# EAGLE design Prog (EAGLE 8.4.0)
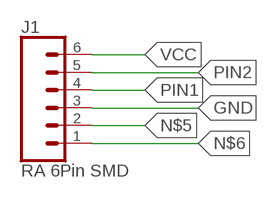
[diagram p0: schematic, sheet 1]

## Parts
J1  RA 6Pin SMD  CONN_06SMD  [1X06-SMD_RA_MALE]

## Nets
GND: J1.3
N$5: J1.2
N$6: J1.1
PIN1: J1.4
PIN2: J1.5
VCC: J1.6

## Library data of the parts
J1 = SparkFun-Connectors:CONN_06: Multi connection point. Often used as Generic Header-pin footprint for 0.1 inch spaced/style header connections On any of the 0.1 inch spaced packages, you can populate with these: Break Away Headers - Straight <https://www.sparkfun.com/products/116> (PRT-00116) Break Away Male Headers - Right Angle <https://www.sparkfun.com/products/553> (PRT-00553) Female Headers <https://www.sparkfun.com/products/115> (PRT-00115) Break Away Headers - Machine Pin <https://www.sparkfun.com/products/117> (PRT-00117) Break Away Female Headers - Swiss Machine Pin <https://www.sparkfun.com/products/743> (PRT-00743) Arduino Stackable Header - 6 Pin <https://www.sparkfun.com/products/9280> (PRT-09280) For SCREWTERMINALS and SPRING TERMINALS visit here: Screw Terimnals on SparkFun.com <https://www.sparkfun.com/search/results?term=Screw+Terminals> (5mm/3.5mm/2.54mm spacing) This device is also useful as a general connection point to wire up your design to another part of your project. Our various solder wires solder well into these plated through hole pads. Hook-Up Wire - Assortment (Stranded, 22 AWG) <https://www.sparkfun.com/products/11375> (PRT-11375) Hook-Up Wire - Assortment (Solid Core, 22 AWG) <https://www.sparkfun.com/products/11367> (PRT-11367) View the entire wire category on our website here <https://www.sparkfun.com/categories/141>; PROD_ID: CONN-08971

## Board
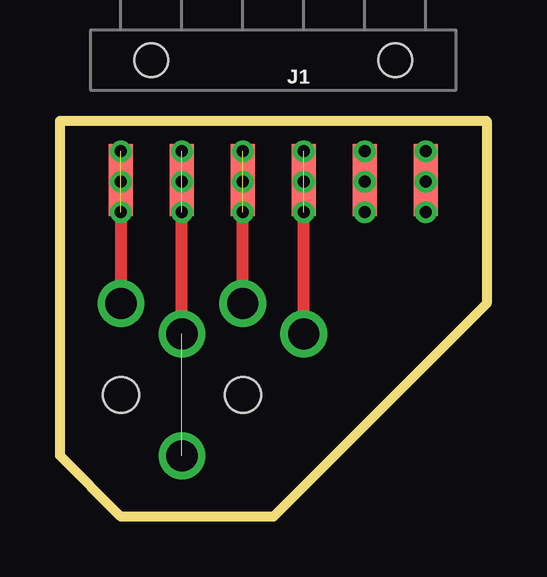
[diagram p1: board, top side]

Size 17.78 x 16.51 mm. Coordinates in mm from the lower left corner, seen from the top.
Outline: 0,16.51 17.78,16.51 17.78,8.89 8.89,0 2.54,0 0,2.54 0,16.51
Copper layers (1*16): Top 0.035mm / dielectric 1.5mm / Bottom 0.035mm
Design rules "default": minimum track width 6mil, minimum drill 0.35mm, track to track 6mil, track to pad 6mil, pad to pad 6mil, via to via 6mil, smd to smd 6mil, copper to edge 40mil, drill to drill 6mil, minimum pad ring 10mil, minimum via ring 8mil, stop-mask expansion 4mil, vias tented up to drill 0mil, thermal gap 10mil
Holes 1.5 mm at 7.62,5.08 2.54,5.08

### Footprints (pad centres in the part's own frame; a part is rotated, then mirrored left to right if it is on the bottom)
1X06-SMD_RA_MALE = smd 1 x 3: 1 -6.35,5; 2 -3.81,5; 3 -1.27,5; 4 1.27,5; 5 3.81,5; 6 6.35,5 | hole 1.4: -5.08,0; 5.08,0

### Placement (x,y rotation side)
J1  8.89,19.05 180 top

### Tracks (layer width: path | path; a pad name or v marks a point on that pad's centre or on a via)
GND  (via drill 0.5, 1.3)  (3 unrouted)
  Top 0.508: v10.16,7.62 J1.3
  other vias: 10.16,15.24 10.16,13.97 10.16,12.7
N$15  (via drill 0.5)
  other vias: 12.7,15.24
N$16  (via drill 0.5)
  other vias: 12.7,13.97
N$17  (via drill 0.5)
  other vias: 12.7,12.7
N$18  (via drill 0.5)
  other vias: 15.24,15.24
N$19  (via drill 0.5)
  other vias: 15.24,13.97
N$20  (via drill 0.5)
  other vias: 15.24,12.7
PIN1  (via drill 0.5, 1.3)  (3 unrouted)
  Top 0.508: v7.62,8.89 J1.4
  other vias: 7.62,15.24 7.62,13.97 7.62,12.7
PIN2  (via drill 0.5, 1.3)  (4 unrouted)
  Top 0.508: v5.08,7.62 v5.08,13.97
  other vias: 5.08,12.7 5.08,15.24 5.08,2.54
VCC  (via drill 0.5, 1.3)  (3 unrouted)
  Top 0.508: v2.54,12.7 v2.54,8.89
  other vias: 2.54,15.24 2.54,13.97